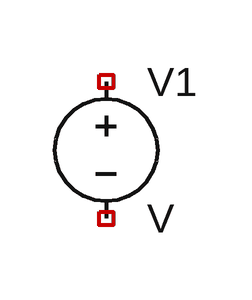
[diagram p0: schematic Draft19.asc]
Draft19.asc, the LTspice schematic file:
Version 4
SHEET 1 880 680
SYMBOL voltage 192 240 R0
SYMATTR InstName V1

The netlist it stands for:
* Draft19.asc
V1 NC_01 NC_02 V
.backanno
.end